# Altium schematic sheet LedMatrixDisplay.SCHDOC
size A4; DocumentNumber: 1; SheetNumber: 1; SheetTotal: 7
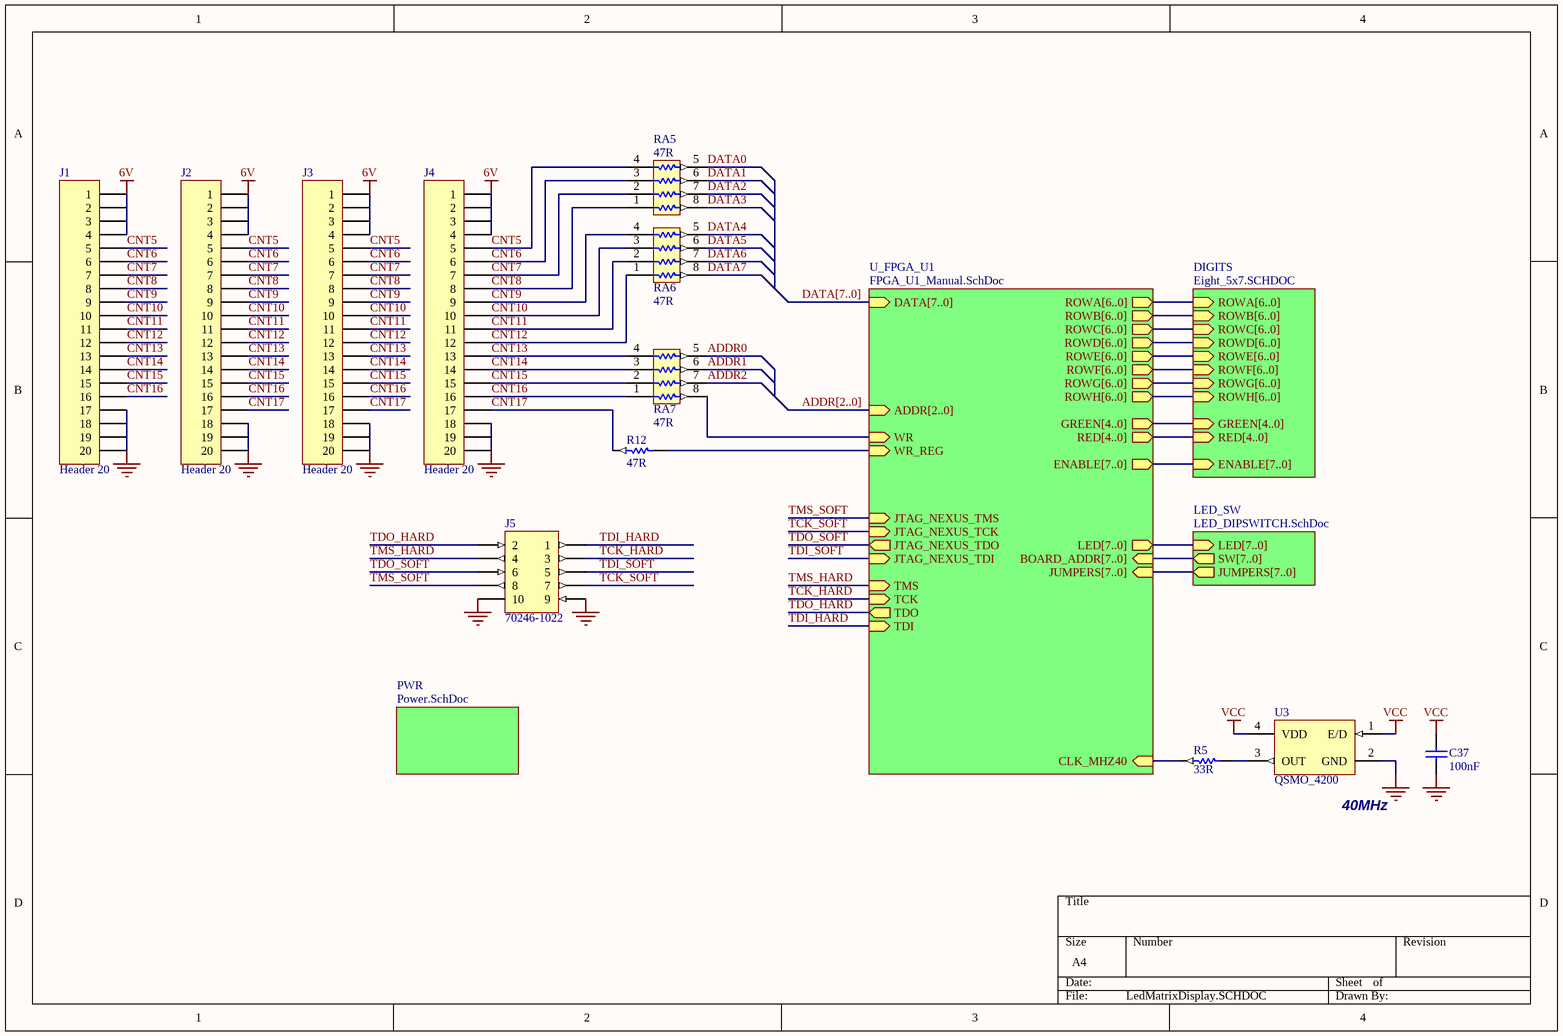
[diagram p0: LedMatrixDisplay.SCHDOC]

## Parts
C37  100nF  [CC2012-0805]
J1  Header 20  [HDR2X10]
J2  Header 20  [HDR2X10]
J3  Header 20  [HDR2X10]
J4  Header 20  [HDR2X10]
J5  70246-1022  [HDR2X5_LP]
R5  33R  [CC2012-0805]
R12  47R  [CC2012-0805]
RA5  47R  [MNR34]
RA6  47R  [MNR34]
RA7  47R  [MNR34]
U3  QSMO_4200  [QSMO_4200]

## Sub-sheets
DIGITS = Eight_5x7.SCHDOC: ROWB[6..0] (in), ROWC[6..0] (in), ROWD[6..0] (in), ROWF[6..0] (in), ROWG[6..0] (in), ROWH[6..0] (in), ROWE[6..0] (in), ROWA[6..0] (in), GREEN[4..0] (in), RED[4..0] (in), ENABLE[7..0] (in)
LED_SW = LED_DIPSWITCH.SchDoc: LED[7..0] (in), SW[7..0] (out), JUMPERS[7..0] (out)
PWR = Power.SchDoc: no entries
U_FPGA_U1 = FPGA_U1_Manual.SchDoc: CLK_MHZ40 (in), DATA[7..0] (in), GREEN[4..0] (out), JTAG_NEXUS_TCK (in), JTAG_NEXUS_TDI (in), JTAG_NEXUS_TDO (out), JTAG_NEXUS_TMS (in), RED[4..0] (out), ADDR[2..0] (in), ROWA[6..0] (out), ROWB[6..0] (out), ROWC[6..0] (out), ROWD[6..0] (out), ROWE[6..0] (out), ROWF[6..0] (out), ROWG[6..0] (out), ROWH[6..0] (out), WR (in), TCK (in), TDI (in), TDO (out), TMS (in), BOARD_ADDR[7..0] (in), LED[7..0] (out), ENABLE[7..0] (out), JUMPERS[7..0] (in), WR_REG (in)

## Nets
6V: J1.1 J1.2 J1.3 J1.4 J2.1 J2.2 J2.3 J2.4 J3.1 J3.2 J3.3 J3.4 J4.1 J4.2 J4.3 J4.4
GND: C37.2 J1.17 J1.18 J1.19 J1.20 J2.18 J2.19 J2.20 J3.18 J3.19 J3.20 J4.18 J4.19 J4.20 J5.9 J5.10 U3.2(GND)
VCC: C37.1 U3.1(E/D) U3.4(VDD)
ADDR0: RA7.5
ADDR1: RA7.6
ADDR2: RA7.7
CNT5: J1.5 J2.5 J3.5 J4.5 RA5.4
CNT6: J1.6 J2.6 J3.6 J4.6 RA5.3
CNT7: J1.7 J2.7 J3.7 J4.7 RA5.2
CNT8: J1.8 J2.8 J3.8 J4.8 RA5.1
CNT9: J1.9 J2.9 J3.9 J4.9 RA6.4
CNT10: J1.10 J2.10 J3.10 J4.10 RA6.3
CNT11: J1.11 J2.11 J3.11 J4.11 RA6.2
CNT12: J1.12 J2.12 J3.12 J4.12 RA6.1
CNT13: J1.13 J2.13 J3.13 J4.13 RA7.4
CNT14: J1.14 J2.14 J3.14 J4.14 RA7.3
CNT15: J1.15 J2.15 J3.15 J4.15 RA7.2
CNT16: J1.16 J2.16 J3.16 J4.16 RA7.1
CNT17: J2.17 J3.17 J4.17 R12.2
DATA0: RA5.5
DATA1: RA5.6
DATA2: RA5.7
DATA3: RA5.8
DATA4: RA6.5
DATA5: RA6.6
DATA6: RA6.7
DATA7: RA6.8
TCK_HARD: J5.3 ; sheet U_FPGA_U1/TCK
TCK_SOFT: J5.7 ; sheet U_FPGA_U1/JTAG_NEXUS_TCK
TDI_HARD: J5.1 ; sheet U_FPGA_U1/TDI
TDI_SOFT: J5.5 ; sheet U_FPGA_U1/JTAG_NEXUS_TDI
TDO_HARD: J5.2 ; sheet U_FPGA_U1/TDO
TDO_SOFT: J5.6 ; sheet U_FPGA_U1/JTAG_NEXUS_TDO
TMS_HARD: J5.4 ; sheet U_FPGA_U1/TMS
TMS_SOFT: J5.8 ; sheet U_FPGA_U1/JTAG_NEXUS_TMS
NetR5_1: R5.1 U3.3(OUT)
NetR5_2: R5.2 ; sheet U_FPGA_U1/CLK_MHZ40
NetR12_1: R12.1 ; sheet U_FPGA_U1/WR_REG
NetRA7_8: RA7.8 ; sheet U_FPGA_U1/WR

## Buses and harness runs
bus ADDR[2..0] = sheet U_FPGA_U1/ADDR[2..0]
bus DATA[7..0] = sheet U_FPGA_U1/DATA[7..0]
bus sheet DIGITS/ENABLE[7..0] = sheet U_FPGA_U1/ENABLE[7..0]
bus sheet DIGITS/GREEN[4..0] = sheet U_FPGA_U1/GREEN[4..0]
bus sheet DIGITS/RED[4..0] = sheet U_FPGA_U1/RED[4..0]
bus sheet DIGITS/ROWA[6..0] = sheet U_FPGA_U1/ROWA[6..0]
bus sheet DIGITS/ROWB[6..0] = sheet U_FPGA_U1/ROWB[6..0]
bus sheet DIGITS/ROWC[6..0] = sheet U_FPGA_U1/ROWC[6..0]
bus sheet DIGITS/ROWD[6..0] = sheet U_FPGA_U1/ROWD[6..0]
bus sheet DIGITS/ROWE[6..0] = sheet U_FPGA_U1/ROWE[6..0]
bus sheet DIGITS/ROWF[6..0] = sheet U_FPGA_U1/ROWF[6..0]
bus sheet DIGITS/ROWG[6..0] = sheet U_FPGA_U1/ROWG[6..0]
bus sheet DIGITS/ROWH[6..0] = sheet U_FPGA_U1/ROWH[6..0]
bus sheet LED_SW/JUMPERS[7..0] = sheet U_FPGA_U1/JUMPERS[7..0]
bus sheet LED_SW/LED[7..0] = sheet U_FPGA_U1/LED[7..0]
bus sheet LED_SW/SW[7..0] = sheet U_FPGA_U1/BOARD_ADDR[7..0]

## Notes on the sheet
- (near U3) 40MHz

## Library data of the parts
C37 = CAP: Capacitor; Fitted: False
J1-J4 = Header 20: Header, 20-Pin; Manufacturer: Generic Components; Class I: Connector; Revision: July-2002: Re-released for DXP Platform.; Publisher: Altium Limited
J5 = Header 5X2: Header, 5-Pin, Dual row; Manufacturer: Molex; Class I: Connector; Fitted: True; Revision: July-2002: Re-released for DXP Platform.; Publisher: Altium Limited
R5 R12 = RES: Resistor; Fitted: False
RA5-RA7 = MNR34: 3216x4 Resistor Array; Fitted: True
U3 = QSMO_4200: Surface Mount Crystal Oscillator; Fitted: False